# Altium project OnePiece_Board.PrjPcb
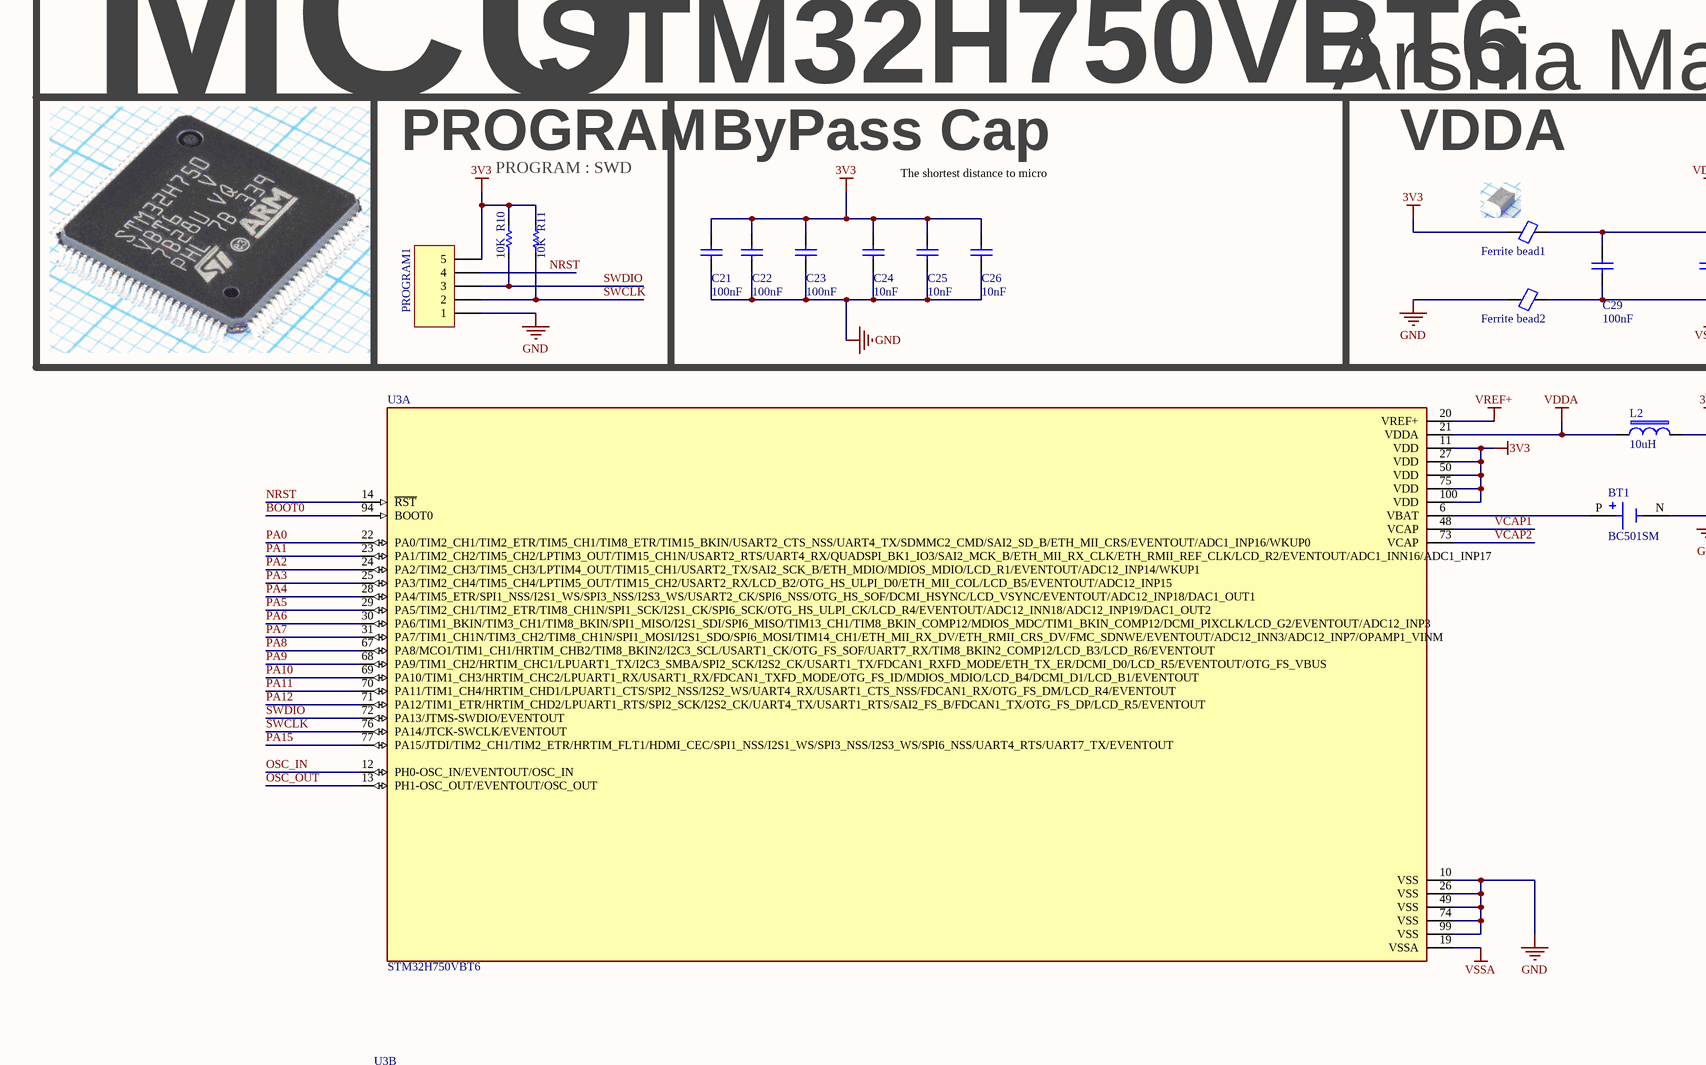
[diagram p0: MCU_STM32H750VBT6.SchDoc, top left]
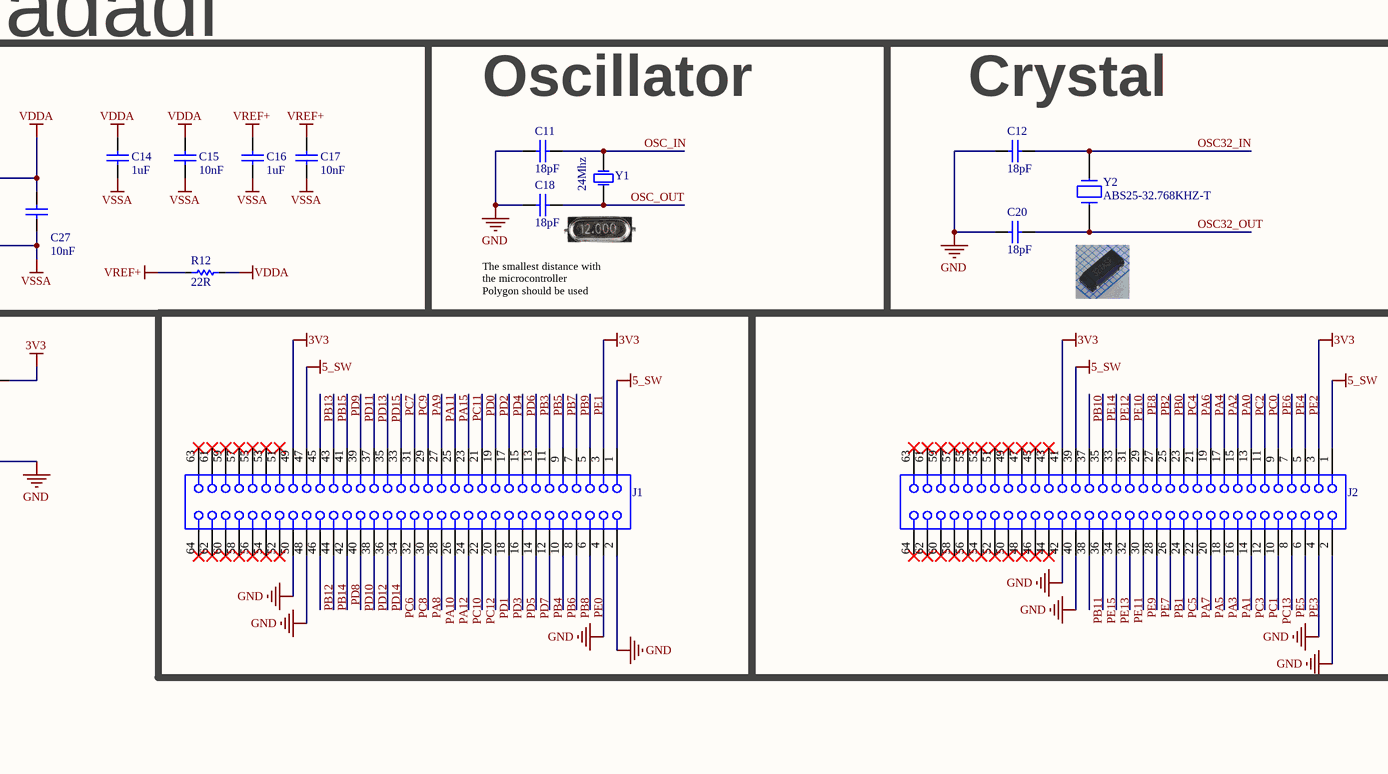
[diagram p1: MCU_STM32H750VBT6.SchDoc, top middle]
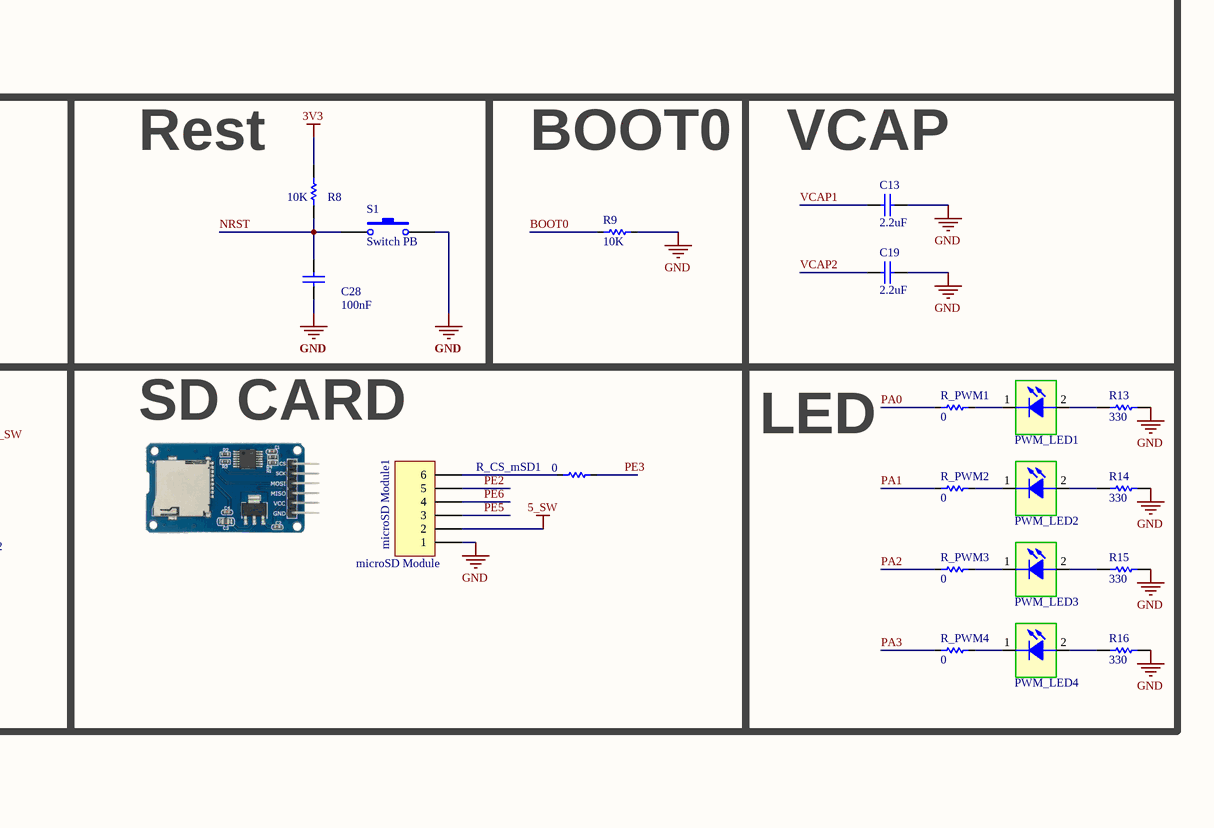
[diagram p2: MCU_STM32H750VBT6.SchDoc, top right]
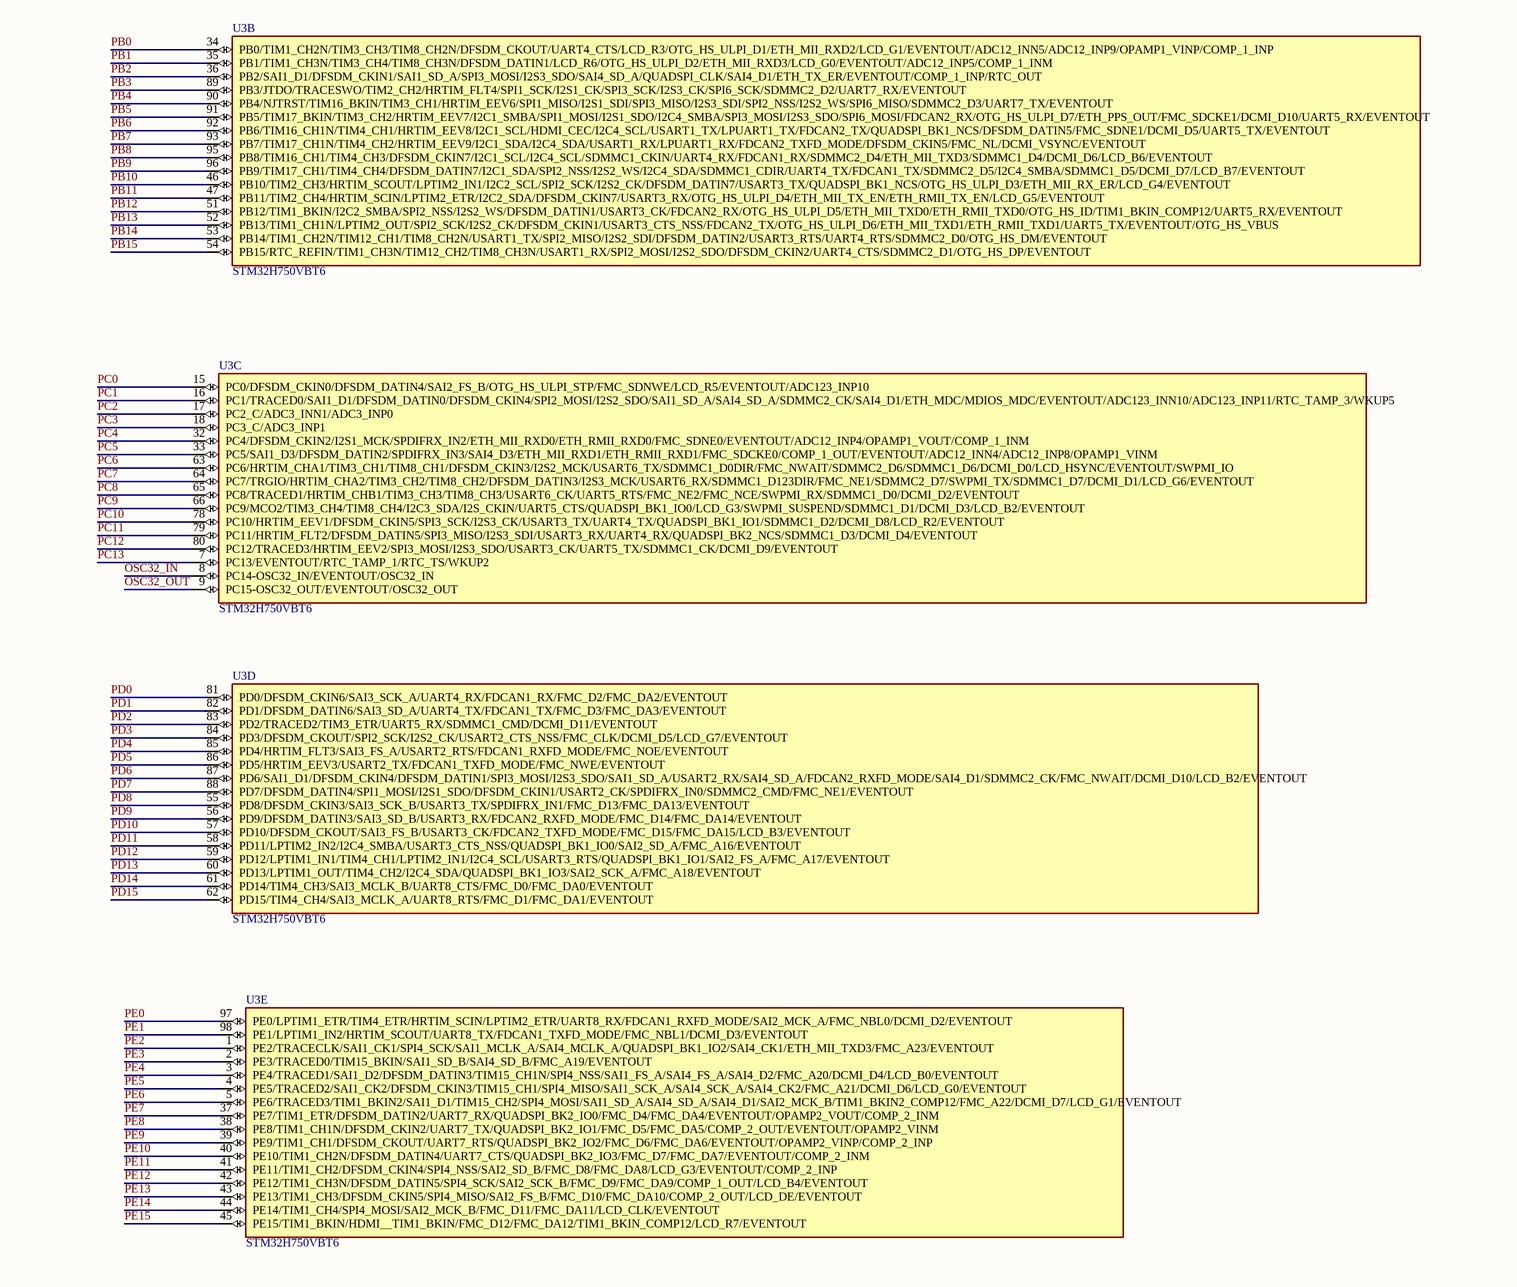
[diagram p3: MCU_STM32H750VBT6.SchDoc, bottom left]
2 sheets, 49 parts. Net scope: global (net labels, ports and power ports of the same name join across sheets).
Board file: OnePiece_Board.PcbDoc
Sheets:
  Power.SchDoc
  MCU_STM32H750VBT6.SchDoc

## Sheet Power.SchDoc
size 381 x 241 mm; SheetNumber: 1; SheetTotal: 1

## Sheet MCU_STM32H750VBT6.SchDoc
size A1; SheetNumber: 2; SheetTotal: 2

### Parts
BT1  BC501SM  [BAT_BC501SM]
C11  18pF  [MY_CAP_SMD_0603]
C12  18pF  [MY_CAP_SMD_0603]
C13  2.2uF  [MY_CAP_SMD_0603]
C14  1uF  [MY_CAP_SMD_0603]
C15  10nF  [MY_CAP_SMD_0603]
C16  1uF  [MY_CAP_SMD_0603]
C17  10nF  [MY_CAP_SMD_0603]
C18  18pF  [MY_CAP_SMD_0603]
C19  2.2uF  [MY_CAP_SMD_0603]
C20  18pF  [MY_CAP_SMD_0603]
C21  100nF  [MY_CAP_SMD_0603]
C22  100nF  [MY_CAP_SMD_0603]
C23  100nF  [MY_CAP_SMD_0603]
C24  10nF  [MY_CAP_SMD_0603]
C25  10nF  [MY_CAP_SMD_0603]
C26  10nF  [MY_CAP_SMD_0603]
C27  10nF  [MY_CAP_SMD_0603]
C28  100nF  [MY_CAP_SMD_0603]
C29  100nF  [MY_CAP_SMD_0603]
Ferrite_bead1  Ferrite Bead SMD  [FB1206]  (value not drawn)
Ferrite_bead2  Ferrite Bead SMD  [FB1206]  (value not drawn)
J1  61306421821  [61306421821]  (value not drawn)
J2  61306421821  [61306421821]  (value not drawn)
L2  10uH  [10UH]
microSD_Module1  microSD Module  [HDR1X6-1]
PROGRAM1  Header 5  [My_1X05]  (value not drawn)
PWM_LED1  SMD 1206 LED  [LED 1206]  (value not drawn)
PWM_LED2  SMD 1206 LED  [LED 1206]  (value not drawn)
PWM_LED3  SMD 1206 LED  [LED 1206]  (value not drawn)
PWM_LED4  SMD 1206 LED  [LED 1206]  (value not drawn)
R8  10K  [RESC4817X04N]
R9  10K  [0805]
R10  10K  [0805]
R11  10K  [0805]
R12  22R  [0805]
R13  330  [RESC3413X04N]
R14  330  [RESC3413X04N]
R15  330  [RESC3413X04N]
R16  330  [RESC3413X04N]
R_CS_mSD1  0  [0805]
R_PWM1  0  [0805]
R_PWM2  0  [0805]
R_PWM3  0  [0805]
R_PWM4  0  [0805]
S1  Switch PB  [SW-PB]
U3  STM32H750VBT6  [QFP50P1600X1600X160-100N]  (parts A,B,C,D,E of 5)
Y1  24Mhz  [Crystal]
Y2  ABS25-32.768KHZ-T  [MY_CRYSTAL_SMD 6 X 3.3]

### Blocks framed on the sheet
MCU: C11-C27 C29 Ferrite_bead1 Ferrite_bead2 PROGRAM1 R10-R12 Y1 Y2
Rest: C28 R8 S1
BOOT0: R9
SD CARD: microSD_Module1 R_CS_mSD1
LED: PWM_LED1-PWM_LED4 R13-R16 R_PWM1-R_PWM4

### Nets
3V3: C21.1 C22.1 C23.1 C24.1 C25.1 C26.1 Ferrite_bead1.1 J1.3 J1.49 J2.3 J2.41 L2.1 PROGRAM1.5 R8.2 R10.2 R11.2 U3.11(VDD) U3.27(VDD) U3.50(VDD) U3.75(VDD) U3.100(VDD)
5_SW: J1.1 J1.47 J2.1 J2.39 microSD_Module1.2
GND: BT1.N(NEG) C11.1 C12.1 C13.2 C18.1 C19.2 C20.1 C21.2 C22.2 C23.2 C24.2 C25.2 C26.2 C28.2 Ferrite_bead2.1 J1.2 J1.4 J1.48 J1.50 J2.2 J2.4 J2.40 J2.42 microSD_Module1.1 PROGRAM1.1 R9.2 R13.1 R14.1 R15.1 R16.1 S1.2 U3.10(VSS) U3.26(VSS) U3.49(VSS) U3.74(VSS) U3.99(VSS)
VDDA: C14.1 C15.1 C27.1 C29.1 Ferrite_bead1.2 L2.2 R12.2 U3.21(VDDA)
VREF+: C16.1 C17.1 R12.1 U3.20(VREF+)
VSSA: C14.2 C15.2 C16.2 C17.2 C27.2 C29.2 Ferrite_bead2.2 U3.19(VSSA)
BOOT0: R9.1 U3.94(BOOT0)
NRST: C28.1 PROGRAM1.4 R8.1 S1.1 U3.14(~{RST})
OSC32_IN: C12.2 U3.8(PC14-OSC32_IN/EVENTOUT/OSC32_IN) Y2.4
OSC32_OUT: C20.2 U3.9(PC15-OSC32_OUT/EVENTOUT/OSC32_OUT) Y2.2
OSC_IN: C11.2 U3.12(PH0-OSC_IN/EVENTOUT/OSC_IN) Y1.2(OSC2)
OSC_OUT: C18.2 U3.13(PH1-OSC_OUT/EVENTOUT/OSC_OUT) Y1.1(OSC1)
PA0: J2.15 R_PWM1.1 U3.22(PA0/TIM2_CH1/TIM2_ETR/TIM5_CH1/TIM8_ETR/TIM15_BKIN/USART2_CTS_NSS/UART4_TX/SDMMC2_CMD/SAI2_SD_B/ETH_MII_CRS/EVENTOUT/ADC1_INP16/WKUP0)
PA1: J2.16 R_PWM2.1 U3.23(PA1/TIM2_CH2/TIM5_CH2/LPTIM3_OUT/TIM15_CH1N/USART2_RTS/UART4_RX/QUADSPI_BK1_IO3/SAI2_MCK_B/ETH_MII_RX_CLK/ETH_RMII_REF_CLK/LCD_R2/EVENTOUT/ADC1_INN16/ADC1_INP17)
PA2: J2.17 R_PWM3.1 U3.24(PA2/TIM2_CH3/TIM5_CH3/LPTIM4_OUT/TIM15_CH1/USART2_TX/SAI2_SCK_B/ETH_MDIO/MDIOS_MDIO/LCD_R1/EVENTOUT/ADC12_INP14/WKUP1)
PA3: J2.18 R_PWM4.1 U3.25(PA3/TIM2_CH4/TIM5_CH4/LPTIM5_OUT/TIM15_CH2/USART2_RX/LCD_B2/OTG_HS_ULPI_D0/ETH_MII_COL/LCD_B5/EVENTOUT/ADC12_INP15)
PA4: J2.19 U3.28(PA4/TIM5_ETR/SPI1_NSS/I2S1_WS/SPI3_NSS/I2S3_WS/USART2_CK/SPI6_NSS/OTG_HS_SOF/DCMI_HSYNC/LCD_VSYNC/EVENTOUT/ADC12_INP18/DAC1_OUT1)
PA5: J2.20 U3.29(PA5/TIM2_CH1/TIM2_ETR/TIM8_CH1N/SPI1_SCK/I2S1_CK/SPI6_SCK/OTG_HS_ULPI_CK/LCD_R4/EVENTOUT/ADC12_INN18/ADC12_INP19/DAC1_OUT2)
PA6: J2.21 U3.30(PA6/TIM1_BKIN/TIM3_CH1/TIM8_BKIN/SPI1_MISO/I2S1_SDI/SPI6_MISO/TIM13_CH1/TIM8_BKIN_COMP12/MDIOS_MDC/TIM1_BKIN_COMP12/DCMI_PIXCLK/LCD_G2/EVENTOUT/ADC12_INP3)
PA7: J2.22 U3.31(PA7/TIM1_CH1N/TIM3_CH2/TIM8_CH1N/SPI1_MOSI/I2S1_SDO/SPI6_MOSI/TIM14_CH1/ETH_MII_RX_DV/ETH_RMII_CRS_DV/FMC_SDNWE/EVENTOUT/ADC12_INN3/ADC12_INP7/OPAMP1_VINM)
PA8: J1.30 U3.67(PA8/MCO1/TIM1_CH1/HRTIM_CHB2/TIM8_BKIN2/I2C3_SCL/USART1_CK/OTG_FS_SOF/UART7_RX/TIM8_BKIN2_COMP12/LCD_B3/LCD_R6/EVENTOUT)
PA9: J1.29 U3.68(PA9/TIM1_CH2/HRTIM_CHC1/LPUART1_TX/I2C3_SMBA/SPI2_SCK/I2S2_CK/USART1_TX/FDCAN1_RXFD_MODE/ETH_TX_ER/DCMI_D0/LCD_R5/EVENTOUT/OTG_FS_VBUS)
PA10: J1.28 U3.69(PA10/TIM1_CH3/HRTIM_CHC2/LPUART1_RX/USART1_RX/FDCAN1_TXFD_MODE/OTG_FS_ID/MDIOS_MDIO/LCD_B4/DCMI_D1/LCD_B1/EVENTOUT)
PA11: J1.27 U3.70(PA11/TIM1_CH4/HRTIM_CHD1/LPUART1_CTS/SPI2_NSS/I2S2_WS/UART4_RX/USART1_CTS_NSS/FDCAN1_RX/OTG_FS_DM/LCD_R4/EVENTOUT)
PA12: J1.26 U3.71(PA12/TIM1_ETR/HRTIM_CHD2/LPUART1_RTS/SPI2_SCK/I2S2_CK/UART4_TX/USART1_RTS/SAI2_FS_B/FDCAN1_TX/OTG_FS_DP/LCD_R5/EVENTOUT)
PA15: J1.25 U3.77(PA15/JTDI/TIM2_CH1/TIM2_ETR/HRTIM_FLT1/HDMI_CEC/SPI1_NSS/I2S1_WS/SPI3_NSS/I2S3_WS/SPI6_NSS/UART4_RTS/UART7_TX/EVENTOUT)
PB0: J2.25 U3.34(PB0/TIM1_CH2N/TIM3_CH3/TIM8_CH2N/DFSDM_CKOUT/UART4_CTS/LCD_R3/OTG_HS_ULPI_D1/ETH_MII_RXD2/LCD_G1/EVENTOUT/ADC12_INN5/ADC12_INP9/OPAMP1_VINP/COMP_1_INP)
PB1: J2.26 U3.35(PB1/TIM1_CH3N/TIM3_CH4/TIM8_CH3N/DFSDM_DATIN1/LCD_R6/OTG_HS_ULPI_D2/ETH_MII_RXD3/LCD_G0/EVENTOUT/ADC12_INP5/COMP_1_INM)
PB2: J2.27 U3.36(PB2/SAI1_D1/DFSDM_CKIN1/SAI1_SD_A/SPI3_MOSI/I2S3_SDO/SAI4_SD_A/QUADSPI_CLK/SAI4_D1/ETH_TX_ER/EVENTOUT/COMP_1_INP/RTC_OUT)
PB3: J1.13 U3.89(PB3/JTDO/TRACESWO/TIM2_CH2/HRTIM_FLT4/SPI1_SCK/I2S1_CK/SPI3_SCK/I2S3_CK/SPI6_SCK/SDMMC2_D2/UART7_RX/EVENTOUT)
PB4: J1.12 U3.90(PB4/NJTRST/TIM16_BKIN/TIM3_CH1/HRTIM_EEV6/SPI1_MISO/I2S1_SDI/SPI3_MISO/I2S3_SDI/SPI2_NSS/I2S2_WS/SPI6_MISO/SDMMC2_D3/UART7_TX/EVENTOUT)
PB5: J1.11 U3.91(PB5/TIM17_BKIN/TIM3_CH2/HRTIM_EEV7/I2C1_SMBA/SPI1_MOSI/I2S1_SDO/I2C4_SMBA/SPI3_MOSI/I2S3_SDO/SPI6_MOSI/FDCAN2_RX/OTG_HS_ULPI_D7/ETH_PPS_OUT/FMC_SDCKE1/DCMI_D10/UART5_RX/EVENTOUT)
PB6: J1.10 U3.92(PB6/TIM16_CH1N/TIM4_CH1/HRTIM_EEV8/I2C1_SCL/HDMI_CEC/I2C4_SCL/USART1_TX/LPUART1_TX/FDCAN2_TX/QUADSPI_BK1_NCS/DFSDM_DATIN5/FMC_SDNE1/DCMI_D5/UART5_TX/EVENTOUT)
PB7: J1.9 U3.93(PB7/TIM17_CH1N/TIM4_CH2/HRTIM_EEV9/I2C1_SDA/I2C4_SDA/USART1_RX/LPUART1_RX/FDCAN2_TXFD_MODE/DFSDM_CKIN5/FMC_NL/DCMI_VSYNC/EVENTOUT)
PB8: J1.8 U3.95(PB8/TIM16_CH1/TIM4_CH3/DFSDM_CKIN7/I2C1_SCL/I2C4_SCL/SDMMC1_CKIN/UART4_RX/FDCAN1_RX/SDMMC2_D4/ETH_MII_TXD3/SDMMC1_D4/DCMI_D6/LCD_B6/EVENTOUT)
PB9: J1.7 U3.96(PB9/TIM17_CH1/TIM4_CH4/DFSDM_DATIN7/I2C1_SDA/SPI2_NSS/I2S2_WS/I2C4_SDA/SDMMC1_CDIR/UART4_TX/FDCAN1_TX/SDMMC2_D5/I2C4_SMBA/SDMMC1_D5/DCMI_D7/LCD_B7/EVENTOUT)
PB10: J2.37 U3.46(PB10/TIM2_CH3/HRTIM_SCOUT/LPTIM2_IN1/I2C2_SCL/SPI2_SCK/I2S2_CK/DFSDM_DATIN7/USART3_TX/QUADSPI_BK1_NCS/OTG_HS_ULPI_D3/ETH_MII_RX_ER/LCD_G4/EVENTOUT)
PB11: J2.38 U3.47(PB11/TIM2_CH4/HRTIM_SCIN/LPTIM2_ETR/I2C2_SDA/DFSDM_CKIN7/USART3_RX/OTG_HS_ULPI_D4/ETH_MII_TX_EN/ETH_RMII_TX_EN/LCD_G5/EVENTOUT)
PB12: J1.46 U3.51(PB12/TIM1_BKIN/I2C2_SMBA/SPI2_NSS/I2S2_WS/DFSDM_DATIN1/USART3_CK/FDCAN2_RX/OTG_HS_ULPI_D5/ETH_MII_TXD0/ETH_RMII_TXD0/OTG_HS_ID/TIM1_BKIN_COMP12/UART5_RX/EVENTOUT)
PB13: J1.45 U3.52(PB13/TIM1_CH1N/LPTIM2_OUT/SPI2_SCK/I2S2_CK/DFSDM_CKIN1/USART3_CTS_NSS/FDCAN2_TX/OTG_HS_ULPI_D6/ETH_MII_TXD1/ETH_RMII_TXD1/UART5_TX/EVENTOUT/OTG_HS_VBUS)
PB14: J1.44 U3.53(PB14/TIM1_CH2N/TIM12_CH1/TIM8_CH2N/USART1_TX/SPI2_MISO/I2S2_SDI/DFSDM_DATIN2/USART3_RTS/UART4_RTS/SDMMC2_D0/OTG_HS_DM/EVENTOUT)
PB15: J1.43 U3.54(PB15/RTC_REFIN/TIM1_CH3N/TIM12_CH2/TIM8_CH3N/USART1_RX/SPI2_MOSI/I2S2_SDO/DFSDM_CKIN2/UART4_CTS/SDMMC2_D1/OTG_HS_DP/EVENTOUT)
PC0: J2.11 U3.15(PC0/DFSDM_CKIN0/DFSDM_DATIN4/SAI2_FS_B/OTG_HS_ULPI_STP/FMC_SDNWE/LCD_R5/EVENTOUT/ADC123_INP10)
PC1: J2.12 U3.16(PC1/TRACED0/SAI1_D1/DFSDM_DATIN0/DFSDM_CKIN4/SPI2_MOSI/I2S2_SDO/SAI1_SD_A/SAI4_SD_A/SDMMC2_CK/SAI4_D1/ETH_MDC/MDIOS_MDC/EVENTOUT/ADC123_INN10/ADC123_INP11/RTC_TAMP_3/WKUP5)
PC2: J2.13 U3.17(PC2_C/ADC3_INN1/ADC3_INP0)
PC3: J2.14 U3.18(PC3_C/ADC3_INP1)
PC4: J2.23 U3.32(PC4/DFSDM_CKIN2/I2S1_MCK/SPDIFRX_IN2/ETH_MII_RXD0/ETH_RMII_RXD0/FMC_SDNE0/EVENTOUT/ADC12_INP4/OPAMP1_VOUT/COMP_1_INM)
PC5: J2.24 U3.33(PC5/SAI1_D3/DFSDM_DATIN2/SPDIFRX_IN3/SAI4_D3/ETH_MII_RXD1/ETH_RMII_RXD1/FMC_SDCKE0/COMP_1_OUT/EVENTOUT/ADC12_INN4/ADC12_INP8/OPAMP1_VINM)
PC6: J1.34 U3.63(PC6/HRTIM_CHA1/TIM3_CH1/TIM8_CH1/DFSDM_CKIN3/I2S2_MCK/USART6_TX/SDMMC1_D0DIR/FMC_NWAIT/SDMMC2_D6/SDMMC1_D6/DCMI_D0/LCD_HSYNC/EVENTOUT/SWPMI_IO)
PC7: J1.33 U3.64(PC7/TRGIO/HRTIM_CHA2/TIM3_CH2/TIM8_CH2/DFSDM_DATIN3/I2S3_MCK/USART6_RX/SDMMC1_D123DIR/FMC_NE1/SDMMC2_D7/SWPMI_TX/SDMMC1_D7/DCMI_D1/LCD_G6/EVENTOUT)
PC8: J1.32 U3.65(PC8/TRACED1/HRTIM_CHB1/TIM3_CH3/TIM8_CH3/USART6_CK/UART5_RTS/FMC_NE2/FMC_NCE/SWPMI_RX/SDMMC1_D0/DCMI_D2/EVENTOUT)
PC9: J1.31 U3.66(PC9/MCO2/TIM3_CH4/TIM8_CH4/I2C3_SDA/I2S_CKIN/UART5_CTS/QUADSPI_BK1_IO0/LCD_G3/SWPMI_SUSPEND/SDMMC1_D1/DCMI_D3/LCD_B2/EVENTOUT)
PC10: J1.24 U3.78(PC10/HRTIM_EEV1/DFSDM_CKIN5/SPI3_SCK/I2S3_CK/USART3_TX/UART4_TX/QUADSPI_BK1_IO1/SDMMC1_D2/DCMI_D8/LCD_R2/EVENTOUT)
PC11: J1.23 U3.79(PC11/HRTIM_FLT2/DFSDM_DATIN5/SPI3_MISO/I2S3_SDI/USART3_RX/UART4_RX/QUADSPI_BK2_NCS/SDMMC1_D3/DCMI_D4/EVENTOUT)
PC12: J1.22 U3.80(PC12/TRACED3/HRTIM_EEV2/SPI3_MOSI/I2S3_SDO/USART3_CK/UART5_TX/SDMMC1_CK/DCMI_D9/EVENTOUT)
PC13: J2.10 U3.7(PC13/EVENTOUT/RTC_TAMP_1/RTC_TS/WKUP2)
PD0: J1.21 U3.81(PD0/DFSDM_CKIN6/SAI3_SCK_A/UART4_RX/FDCAN1_RX/FMC_D2/FMC_DA2/EVENTOUT)
PD1: J1.20 U3.82(PD1/DFSDM_DATIN6/SAI3_SD_A/UART4_TX/FDCAN1_TX/FMC_D3/FMC_DA3/EVENTOUT)
PD2: J1.19 U3.83(PD2/TRACED2/TIM3_ETR/UART5_RX/SDMMC1_CMD/DCMI_D11/EVENTOUT)
PD3: J1.18 U3.84(PD3/DFSDM_CKOUT/SPI2_SCK/I2S2_CK/USART2_CTS_NSS/FMC_CLK/DCMI_D5/LCD_G7/EVENTOUT)
PD4: J1.17 U3.85(PD4/HRTIM_FLT3/SAI3_FS_A/USART2_RTS/FDCAN1_RXFD_MODE/FMC_NOE/EVENTOUT)
PD5: J1.16 U3.86(PD5/HRTIM_EEV3/USART2_TX/FDCAN1_TXFD_MODE/FMC_NWE/EVENTOUT)
PD6: J1.15 U3.87(PD6/SAI1_D1/DFSDM_CKIN4/DFSDM_DATIN1/SPI3_MOSI/I2S3_SDO/SAI1_SD_A/USART2_RX/SAI4_SD_A/FDCAN2_RXFD_MODE/SAI4_D1/SDMMC2_CK/FMC_NWAIT/DCMI_D10/LCD_B2/EVENTOUT)
PD7: J1.14 U3.88(PD7/DFSDM_DATIN4/SPI1_MOSI/I2S1_SDO/DFSDM_CKIN1/USART2_CK/SPDIFRX_IN0/SDMMC2_CMD/FMC_NE1/EVENTOUT)
PD8: J1.42 U3.55(PD8/DFSDM_CKIN3/SAI3_SCK_B/USART3_TX/SPDIFRX_IN1/FMC_D13/FMC_DA13/EVENTOUT)
PD9: J1.41 U3.56(PD9/DFSDM_DATIN3/SAI3_SD_B/USART3_RX/FDCAN2_RXFD_MODE/FMC_D14/FMC_DA14/EVENTOUT)
PD10: J1.40 U3.57(PD10/DFSDM_CKOUT/SAI3_FS_B/USART3_CK/FDCAN2_TXFD_MODE/FMC_D15/FMC_DA15/LCD_B3/EVENTOUT)
PD11: J1.39 U3.58(PD11/LPTIM2_IN2/I2C4_SMBA/USART3_CTS_NSS/QUADSPI_BK1_IO0/SAI2_SD_A/FMC_A16/EVENTOUT)
PD12: J1.38 U3.59(PD12/LPTIM1_IN1/TIM4_CH1/LPTIM2_IN1/I2C4_SCL/USART3_RTS/QUADSPI_BK1_IO1/SAI2_FS_A/FMC_A17/EVENTOUT)
PD13: J1.37 U3.60(PD13/LPTIM1_OUT/TIM4_CH2/I2C4_SDA/QUADSPI_BK1_IO3/SAI2_SCK_A/FMC_A18/EVENTOUT)
PD14: J1.36 U3.61(PD14/TIM4_CH3/SAI3_MCLK_B/UART8_CTS/FMC_D0/FMC_DA0/EVENTOUT)
PD15: J1.35 U3.62(PD15/TIM4_CH4/SAI3_MCLK_A/UART8_RTS/FMC_D1/FMC_DA1/EVENTOUT)
PE0: J1.6 U3.97(PE0/LPTIM1_ETR/TIM4_ETR/HRTIM_SCIN/LPTIM2_ETR/UART8_RX/FDCAN1_RXFD_MODE/SAI2_MCK_A/FMC_NBL0/DCMI_D2/EVENTOUT)
PE1: J1.5 U3.98(PE1/LPTIM1_IN2/HRTIM_SCOUT/UART8_TX/FDCAN1_TXFD_MODE/FMC_NBL1/DCMI_D3/EVENTOUT)
PE2: J2.5 microSD_Module1.5 U3.1(PE2/TRACECLK/SAI1_CK1/SPI4_SCK/SAI1_MCLK_A/SAI4_MCLK_A/QUADSPI_BK1_IO2/SAI4_CK1/ETH_MII_TXD3/FMC_A23/EVENTOUT)
PE3: J2.6 R_CS_mSD1.1 U3.2(PE3/TRACED0/TIM15_BKIN/SAI1_SD_B/SAI4_SD_B/FMC_A19/EVENTOUT)
PE4: J2.7 U3.3(PE4/TRACED1/SAI1_D2/DFSDM_DATIN3/TIM15_CH1N/SPI4_NSS/SAI1_FS_A/SAI4_FS_A/SAI4_D2/FMC_A20/DCMI_D4/LCD_B0/EVENTOUT)
PE5: J2.8 microSD_Module1.3 U3.4(PE5/TRACED2/SAI1_CK2/DFSDM_CKIN3/TIM15_CH1/SPI4_MISO/SAI1_SCK_A/SAI4_SCK_A/SAI4_CK2/FMC_A21/DCMI_D6/LCD_G0/EVENTOUT)
PE6: J2.9 microSD_Module1.4 U3.5(PE6/TRACED3/TIM1_BKIN2/SAI1_D1/TIM15_CH2/SPI4_MOSI/SAI1_SD_A/SAI4_SD_A/SAI4_D1/SAI2_MCK_B/TIM1_BKIN2_COMP12/FMC_A22/DCMI_D7/LCD_G1/EVENTOUT)
PE7: J2.28 U3.37(PE7/TIM1_ETR/DFSDM_DATIN2/UART7_RX/QUADSPI_BK2_IO0/FMC_D4/FMC_DA4/EVENTOUT/OPAMP2_VOUT/COMP_2_INM)
PE8: J2.29 U3.38(PE8/TIM1_CH1N/DFSDM_CKIN2/UART7_TX/QUADSPI_BK2_IO1/FMC_D5/FMC_DA5/COMP_2_OUT/EVENTOUT/OPAMP2_VINM)
PE9: J2.30 U3.39(PE9/TIM1_CH1/DFSDM_CKOUT/UART7_RTS/QUADSPI_BK2_IO2/FMC_D6/FMC_DA6/EVENTOUT/OPAMP2_VINP/COMP_2_INP)
PE10: J2.31 U3.40(PE10/TIM1_CH2N/DFSDM_DATIN4/UART7_CTS/QUADSPI_BK2_IO3/FMC_D7/FMC_DA7/EVENTOUT/COMP_2_INM)
PE11: J2.32 U3.41(PE11/TIM1_CH2/DFSDM_CKIN4/SPI4_NSS/SAI2_SD_B/FMC_D8/FMC_DA8/LCD_G3/EVENTOUT/COMP_2_INP)
PE12: J2.33 U3.42(PE12/TIM1_CH3N/DFSDM_DATIN5/SPI4_SCK/SAI2_SCK_B/FMC_D9/FMC_DA9/COMP_1_OUT/LCD_B4/EVENTOUT)
PE13: J2.34 U3.43(PE13/TIM1_CH3/DFSDM_CKIN5/SPI4_MISO/SAI2_FS_B/FMC_D10/FMC_DA10/COMP_2_OUT/LCD_DE/EVENTOUT)
PE14: J2.35 U3.44(PE14/TIM1_CH4/SPI4_MOSI/SAI2_MCK_B/FMC_D11/FMC_DA11/LCD_CLK/EVENTOUT)
PE15: J2.36 U3.45(PE15/TIM1_BKIN/HDMI__TIM1_BKIN/FMC_D12/FMC_DA12/TIM1_BKIN_COMP12/LCD_R7/EVENTOUT)
SWCLK: PROGRAM1.2 R11.1 U3.76(PA14/JTCK-SWCLK/EVENTOUT)
SWDIO: PROGRAM1.3 R10.1 U3.72(PA13/JTMS-SWDIO/EVENTOUT)
VCAP1: C13.1 U3.48(VCAP)
VCAP2: C19.1 U3.73(VCAP)
NetBT1_P: BT1.P(POS) U3.6(VBAT)
NetmicroSD_Module1_6: microSD_Module1.6 R_CS_mSD1.2
NetPWM_LED1_1: PWM_LED1.1 R_PWM1.2
NetPWM_LED1_2: PWM_LED1.2 R13.2
NetPWM_LED2_1: PWM_LED2.1 R_PWM2.2
NetPWM_LED2_2: PWM_LED2.2 R14.2
NetPWM_LED3_1: PWM_LED3.1 R_PWM3.2
NetPWM_LED3_2: PWM_LED3.2 R15.2
NetPWM_LED4_1: PWM_LED4.1 R_PWM4.2
NetPWM_LED4_2: PWM_LED4.2 R16.2

Not connected (* = marked no-connect by the designer): J1 51* 52* 53* 54* 55* 56* 57* 58* 59* 60* 61* 62* 63* 64*; J2 43* 44* 45* 46* 47* 48* 49* 50* 51* 52* 53* 54* 55* 56* 57* 58* 59* 60* 61* 62* 63* 64*; Y2 1 3

### Notes on the sheet
- STM32H750VBT6
- Arshia Madadi
- PROGRAM
- PROGRAM : SWD
- ByPass Cap
- The shortest distance to micro
- VDDA
- Oscillator
- (near C12) Crystal
- (near C13) VCAP
- The smallest distance with the microcontroller
  Polygon should be used

### Library data of the parts
BT1 = BC501SM: BATTERY HOLDER COIN 12MM SMD; MF: MPD; SnapEDA_Link: https://www.snapeda.com/parts/BC501SM/MPD/view-part/?ref=snap; Package: None; MP: BC501SM; Price: None; Availability: Unavailable; Check_prices: https://www.snapeda.com/parts/BC501SM/MPD/view-part/?ref=eda; Value: *
C11-C29 = CAP SMD_0603
Ferrite_bead1 Ferrite_bead2 = Ferrite Bead SMD Package: Designer: Ali Hafizi
J1 J2 = 61306421821: WR-PHD Socket Header, THT, Vertical, pitch 2.54mm, 2 Row, 64P; Manufacturer: Wurth Elektronik; Contact Resistance: 20mOhm; Rated Current: 3A; Working Voltage: 250V; Withstanding Voltage: 500V; Manufacturer Part Number: 61306421821; Category: Board-to-Board Connectors; Match Code: WR-PHD; ComponentLink1Description: Website Link; ComponentLink1URL: https://www.we-online.com/redexpert/article/61306421821?ad; ComponentLink2Description: Datasheet Link; ComponentLink2URL: https://www.we-online.com/redexpert/spec/61306421821?ad; Mount: Through Hole; Operating Temperature Max: 125°C; Operating Temperature Min: -40°C; Packaging: Tray; Gender: Socket Header; Number of Pins: 64; Number of Rows: 2; Orientation: Vertical; Pitch: 2.54mm
L2 = Inductor_B: Inductor; Code_IEC: 1005; Published: 8-Jun-2000; LatestRevisionDate: 17-Jul-2002; LatestRevisionNote: Re-released for DXP Platform.; PackageReference: 0402-A; Publisher: Altium Limited; Code_JEITA: 0402
microSD_Module1 = Header 6: Header, 6-Pin; LatestRevisionDate: 17-Jul-2002; LatestRevisionNote: Re-released for DXP Platform.; Publisher: Altium Limited
PROGRAM1 = Header 5: Header, 5-Pin; LatestRevisionDate: 17-Jul-2002; LatestRevisionNote: Re-released for DXP Platform.; Publisher: Altium Limited
PWM_LED1-PWM_LED4 = LED SMD 1206
R8 = RES 1206 0.25W: RES 1206; Designer: Abbas Basereh; Desc.: RES SMD 1206; Data: 16-12-2016
R9-R12 R_CS_mSD1 R_PWM1-R_PWM4 = Res: Resistor; Published: 8-Jun-2000; LatestRevisionDate: 17-Jul-2002; LatestRevisionNote: Re-released for DXP Platform.; PackageReference: AXIAL-0.3; Publisher: Altium Limited
R13-R16 = RES 0805 0.125W: RES 0805; Designer: Abbas Basereh; Desc.: RES SMD 0805; Data: 16-12-2016
S1 = Switch PB: Push Button Switch
U3 = STM32H750VBT6: ARMÂ® CortexÂ®-M7 STM32H7 Microcontroller IC 32-Bit Single-Core 480MHz 128KB (128K x 8) FLASH 100-LQFP (14x14); MF: STMicroelectronics; MP: STM32H750VBT6; Package: LQFP-100 STMicroelectronics; Purchase-URL: https://pricing.snapeda.com/search/part/STM32H750VBT6/?ref=eda; Check_prices: https://www.snapeda.com/parts/STM32H750VBT6/STMicroelectronics/view-part/?ref=eda; Availability: In Stock; Price: None; SnapEDA_Link: https://www.snapeda.com/parts/STM32H750VBT6/STMicroelectronics/view-part/?ref=snap; Value: *
Y1 = XTAL: Crystal Oscillator; Published: 8-Jun-2000; LatestRevisionDate: 17-Jul-2002; LatestRevisionNote: Re-released for DXP Platform.; PackageReference: R38; Publisher: Altium Limited
Y2 = CRYSTAL_SMD-6X3.3: Crystal